# EAGLE schematic musb-input-breakout (EAGLE 9.0.1)
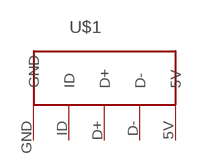
[diagram p0: schematic, sheet 1]

## Parts
U$1  MICRO-USB  [MICRO-USB]
Unconnected: U$1.5V U$1.D+ U$1.D- U$1.GND U$1.ID

## Library data of the parts
U$1 = mask_lbr:MICRO-USB